# Altium schematic sheet CH552DAPLINK.SchDoc
size A4
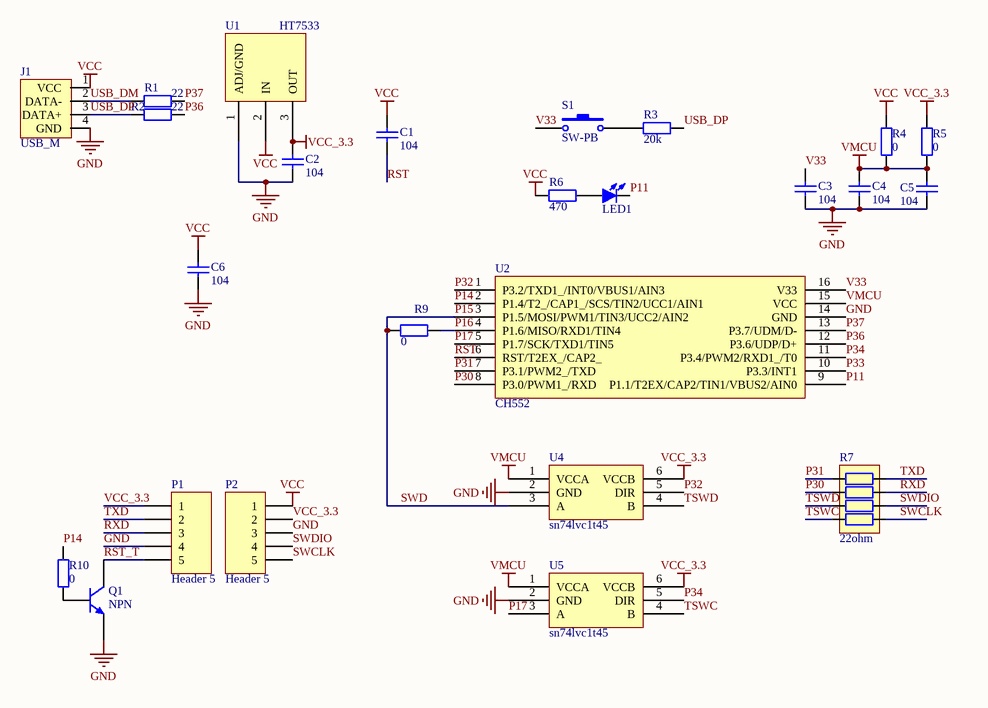
[diagram p0: CH552DAPLINK.SchDoc]

## Parts
C1  value 104  [MY0603_c]  (hidden comment: Cap)
C2  value 104  [MY0805_C]  (hidden comment: Cap)
C3  value 104  [MY0805_C]  (hidden comment: Cap)
C4  value 104  [MY0603_c]  (hidden comment: Cap)
C5  value 104  [MY0805_C]  (hidden comment: Cap)
C6  value 104  [MY0805_C]  (hidden comment: Cap)
J1  USB_M  [USB_micro_常用]
LED1  LED-SMD  [MY-0603_LED_B]  (value not drawn)
P1  Header 5  [header5]
P2  Header 5  [header5]
Q1  NPN  [MY_SOT23_BJT]
R1  value 22  [my0603_R]  (hidden comment: Res2)
R2  value 22  [my0603_R]  (hidden comment: Res2)
R3  value 20k  [my0603_r]  (hidden comment: Res2)
R4  value 0  [my0603_r]  (hidden comment: Res2)
R5  value 0  [my0603_r]  (hidden comment: Res2)
R6  value 470  [my0603_r]  (hidden comment: Res2)
R7  22ohm  [RCA-8P4R-0603]
R9  value 0  [my0603_r]  (hidden comment: Res2)
R10  value 0  [my0603_r]  (hidden comment: Res2)
S1  SW-PB  [key_MICRO]
U1  HT7533  [MY_SOT-89-3]
U2  CH552  [MY-SOP-16_150mil]
U4  sn74lvc1t45  [MY-SOT-23-6]
U5  sn74lvc1t45  [MY-SOT-23-6]

## Nets
GND: C2.2 C3.2 C4.2 C5.2 C6.2 J1.4(GND) P1.4 P2.3 Q1.2(E) U1.1(ADJ/GND) U2.14(GND) U4.2(GND) U5.2(GND)
VCC: C1.1 C6.1 J1.1(VCC) P2.1 R4.2 R6.1 U1.2(IN)
VCC_3.3: C2.1 P1.1 P2.2 R5.2 U1.3(OUT) U4.6(VCCB) U5.6(VCCB)
VMCU: C4.1 C5.1 R4.1 R5.1 U2.15(VCC) U4.1(VCCA) U5.1(VCCA)
P11: LED1.K U2.9(P1.1/T2EX/CAP2/TIN1/VBUS2/AIN0)
P14: R10.1 U2.2(P1.4/T2_/CAP1_/SCS/TIN2/UCC1/AIN1)
P15: R9.2 U2.3(P1.5/MOSI/PWM1/TIN3/UCC2/AIN2) U4.3(A)  [also labelled SWD]
P16: R9.1 U2.4(P1.6/MISO/RXD1/TIN4)
P17: U2.5(P1.7/SCK/TXD1/TIN5) U5.3(A)
P30: R7.7 U2.8(P3.0/PWM1_/RXD)
P31: R7.8 U2.7(P3.1/PWM2_/TXD)
P32: U2.1(P3.2/TXD1_/INT0/VBUS1/AIN3) U4.5(DIR)
P33: U2.10(P3.3/INT1)
P34: U2.11(P3.4/PWM2/RXD1_/T0) U5.5(DIR)
P36: R2.2 U2.12(P3.6/UDP/D+)
P37: R1.2 U2.13(P3.7/UDM/D-)
RST: C1.2 U2.6(RST/T2EX_/CAP2_)
RST_T: P1.5 Q1.3(C)
RXD: P1.3 R7.2
SWCLK: P2.5 R7.4
SWDIO: P2.4 R7.3
TSWC: R7.5 U5.4(B)
TSWD: R7.6 U4.4(B)
TXD: P1.2 R7.1
USB_DM: J1.2(DATA-) R1.1
USB_DP: J1.3(DATA+) R2.1 R3.2
V33: C3.1 S1.1 U2.16(V33)
NetLED1_A: LED1.A R6.2
NetQ1_1: Q1.1(B) R10.2
NetR3_1: R3.1 S1.2

## Library data of the parts
C1-C6 = Cap: Capacitor; Published: 8-Jun-2000; LatestRevisionDate: 17-Jul-2002; LatestRevisionNote: Re-released for DXP Platform.; PackageReference: RAD-0.3; Publisher: Altium Limited; PackageDescription: Radial Cap, Thru-Hole; 2 Leads; 0.3 in Pin Spacing
LED1 = LED-SMD: 贴片LED; BOM名称: 贴片LED
P1 P2 = Header 5: Header, 5-Pin; LatestRevisionDate: 17-Jul-2002; LatestRevisionNote: Re-released for DXP Platform.; Publisher: Altium Limited
Q1 = NPN_SOT23: NPN Bipolar Transistor; Published: 8-Jun-2000; LatestRevisionDate: 17-Jul-2002; LatestRevisionNote: Re-released for DXP Platform.; PackageReference: SOT23; Publisher: Altium Limited; PackageDescription: TO, Flat Index; 3 In-Line, Axial Leads; Body Dia. 4.8mm; Leads 0.55 x 0.51 mm (max); Code_JEDEC: SOT23
R1-R6 R9 R10 = Res2: Resistor; Published: 8-Jun-2000; LatestRevisionDate: 17-Jul-2002; LatestRevisionNote: Re-released for DXP Platform.; PackageReference: AXIAL-0.4; Publisher: Altium Limited; PackageDescription: Axial Device, Thru-Hole; 2 Leads; 0.4 in Pin Spacing
R7 = R-8P4R: 贴片网络排阻; 版权归属: 源创客; BOM名称: 贴片网络排阻; 学习资源: www.ooocke.com
S1 = SW-PB: Switch; Published: 24-Mar-1999; LatestRevisionDate: 17-Jul-2002; LatestRevisionNote: Re-released for DXP Platform.; PackageReference: SPST-2; Publisher: Altium Limited; PackageDescription: Switch; 2 Leads
U4 U5 = TMP122